# Altium schematic sheet GPIO_Expander2.SchDoc
size A4; SheetNumber: 5; SheetTotal: 7
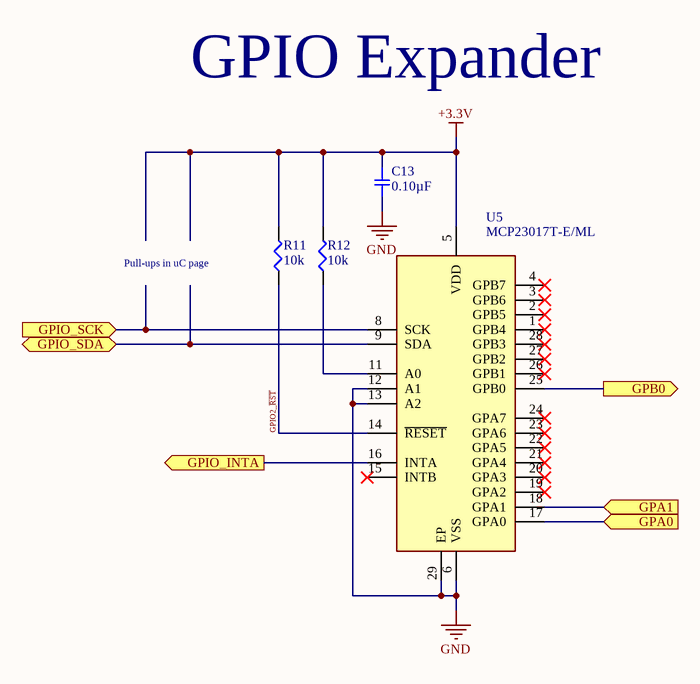
[diagram p0: GPIO_Expander2.SchDoc]

## Parts
C13  0.10µF  [SMD-0402C]
R11  10k  [SMD-0402-RES]
R12  10k  [SMD-0402-RES]
U5  MCP23017T-E/ML  [QFN65P600X600X100-29N-D]

## Ports
GPA0 (in), GPA1 (in), GPB0 (out), GPIO_INTA (out), GPIO_SCK (in), GPIO_SDA (bidir)

## Nets
+3.3V: C13.1 R11.2 R12.2 U5.5(VDD)
GND: C13.2 U5.6(VSS) U5.12(A1) U5.13(A2) U5.29(EP)
GPA0: U5.17(GPA0) ; port GPA0
GPA1: U5.18(GPA1) ; port GPA1
GPB0: U5.25(GPB0) ; port GPB0
GPIO2_~{RST}: R11.1 U5.14(~{RESET})
GPIO_INTA: U5.16(INTA) ; port GPIO_INTA
GPIO_SCK: U5.8(SCK) ; port GPIO_SCK
GPIO_SDA: U5.9(SDA) ; port GPIO_SDA
NetR12_1: R12.1 U5.11(A0)

Not connected (* = marked no-connect by the designer): U5 1(GPB4)* 2(GPB5)* 3(GPB6)* 4(GPB7)* 7(NC_1) 10(NC_2) 15(INTB)* 19(GPA2)* 20(GPA3)* 21(GPA4)* 22(GPA5)* 23(GPA6)* 24(GPA7)* 26(GPB1)* 27(GPB2)* 28(GPB3)*

## Notes on the sheet
- GPIO Expander
- (near R11) Pull-ups in uC page

## Library data of the parts
C13 = GCM155R71C104KA55D: CAP CER 0.1UF 16V X7R 0402; Manufacturer: Murata Electronics North America; Factory Stock: 0; Unit Price (USD): 0.1; Minimum Quantity: 1; Tolerance: ±10%; Datasheets: http://www.murata.com/~/media/webrenewal/support/library/catalog/products/capacitor/mlcc/c03e.ashx; Image: //media.digikey.com/Renders/Murata%20Renders/ZRB-SERIES-0402.jpg; Digi-Key Part Number: 490-4759-1-ND; Part Number: GCM155R71C104KA55D; Quantity Available: 734194; @ qty: 0; Packaging: Cut Tape (CT); Series: GCM; Part Status: Active; Value: 0.10µF; Voltage: 16V; Temperature Coefficient: X7R; Operating Temperature: -55°C ~ 125°C; Features: -; Ratings: AEC-Q200; Applications: Automotive; Mounting Type: Surface Mount, MLCC; Package / Case: 0402 (1005 Metric); Size / Dimension: 0.039" L x 0.020" W (1.00mm x 0.50mm); Height - Seated (Max): -; Thickness (Max): 0.022" (0.55mm); Lead Spacing: -; Lead Style: -
R11 R12 = ERJ-2RKF1002X: RES SMD 10K OHM 1% 1/10W 0402; Manufacturer: Panasonic Electronic Components; Factory Stock: 0; Unit Price (USD): 0.00496; @ qty: 1500; Minimum Quantity: 1; Power (Watts): 0.1W, 1/10W; Temperature Coefficient: ±100ppm/°C; Part Number: ERJ-2RKF1002X; Datasheets: http://industrial.panasonic.com/www-cgi/jvcr13pz.cgi?E+PZ+3+AOA0002+ERJ2RKF1002X+7+WW; Image: //media.digikey.com/Photos/Panasonic%20Photos/ERJ-PA2-Series.jpg; Digi-Key Part Number: P10.0KLCT-ND; Quantity Available: 9922786; Packaging: Cut Tape (CT); Series: ERJ; Part Status: Active; Value: 10k; Tolerance: ±1%; Composition: Thick Film; Features: Automotive AEC-Q200; Operating Temperature: -55°C ~ 155°C; Package / Case: 0402 (1005 Metric); Supplier Device Package: 0402; Size / Dimension: 0.039" L x 0.020" W (1.00mm x 0.50mm); Height - Seated (Max): 0.016" (0.40mm); Number of Terminations: 2; Failure Rate: -
U5 = MCP23017T-E/ML: Interface - I/O Expanders 16bit Input/Output Exp I2C interface; Manufacturer_Name: Microchip; Datasheet Link: https://datasheet.datasheetarchive.com/originals/distributors/SFDatasheet-4/sf-00090057.pdf; Height: 1mm; Manufacturer_Part_Number: MCP23017T-E/ML; Mouser Part Number: 579-MCP23017T-E/ML; Mouser Price/Stock: https://www.mouser.co.uk/ProductDetail/Microchip-Technology/MCP23017T-E-ML?qs=usxtMOJb1RwLvxs2MXknpg%3D%3D; Arrow Part Number: MCP23017T-E/ML; Arrow Price/Stock: https://www.arrow.com/en/products/mcp23017t-eml/microchip-technology.html?utm_currency=USD&region=nac; Value: MCP23017T-E/ML